# EAGLE design MergenElektronik_Developing-Board_ESP32 (EAGLE 9.6.2)

## Sheet 1 of 5
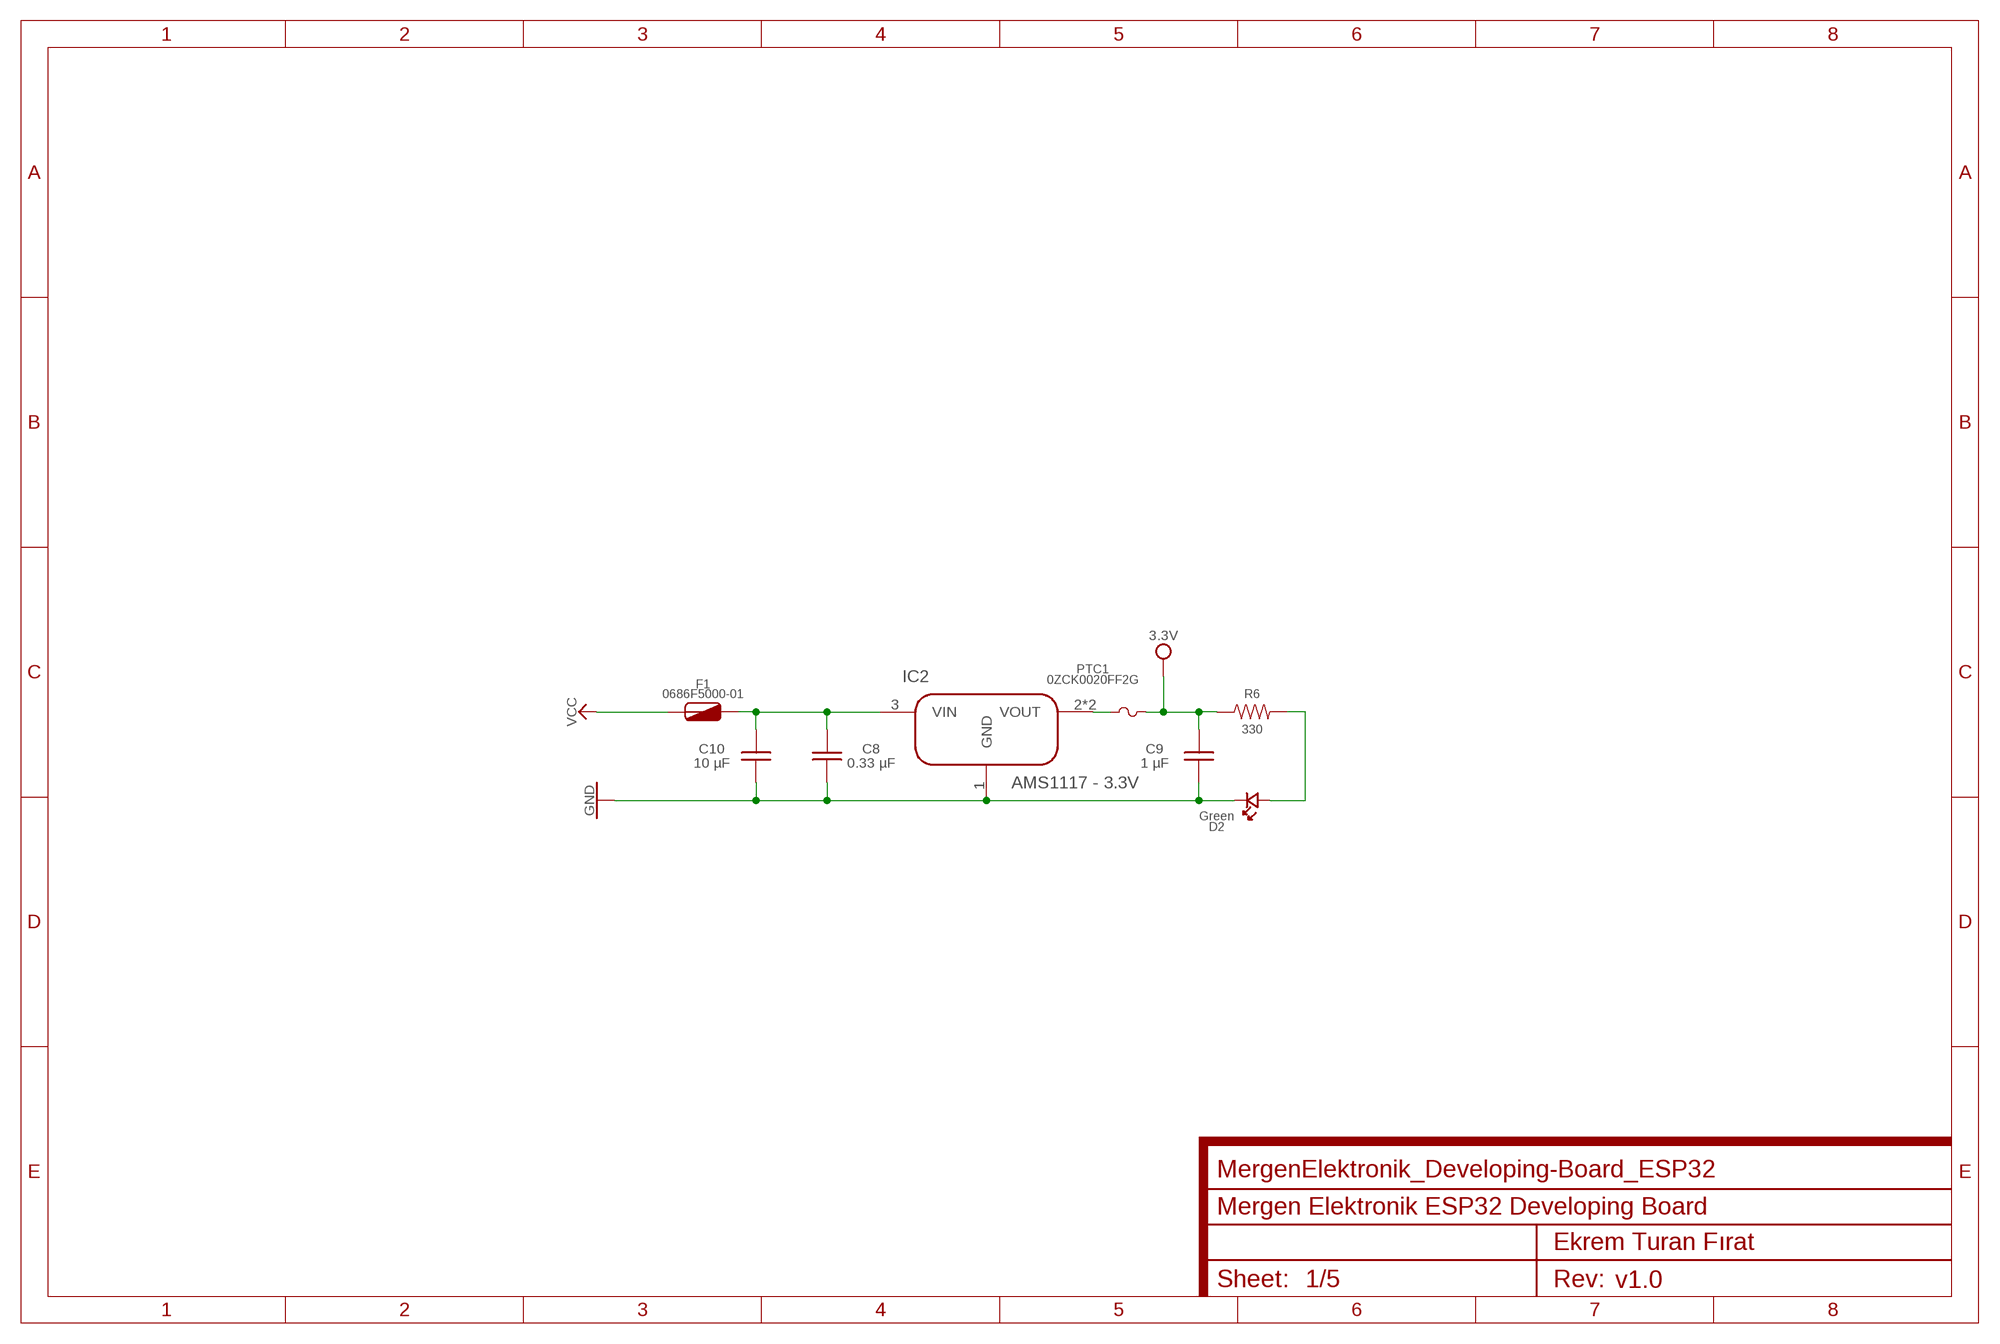
[diagram p0: schematic, sheet 1]
A4_PAGE1 (NACHTELK_AESTHETICS_A4): DRAWING_DESCRIPTION: Mergen Elektronik ESP32 Developing Board; DRAWING_DESIGNER: Ekrem Turan Fırat; DRAWING_REVISION: v1.0

### Parts
C8  0.33 µF  NACHTELK_CAP-NONPOLAR-SMD_0.33UF_0603  [0603]
C9  1 µF  NACHTELK_CAP-NONPOLAR-SMD_1UF_0603  [0603]
C10  10 µF  NACHTELK_CAP-NONPOLAR-SMD_10UF_0603  [0603]
D2  Green  NACHTELK_LED_SMD_0603_GREEN  [0603_GREEN]
F1  0686F5000-01  NACHTELK_FUSES_SMD_5A_0603  [0603]
IC2  AMS1117 - 3.3V  NACHTELK_LINEAR-REG_AMS1117_3.3V  [SOT-223]
PTC1  0ZCK0020FF2G  NACHHTELK_PTCS-SMD_0ZCK0020FF2G_0805  [0805]
R6  330  NACHTELK_RES-SMD_330R_0603  [0603]

### Nets
3V3: C9.1 PTC1.2 R6.1 ; supply symbol labelled 3.3V ; also sheet 2,4,5
GND: C8.2 C9.2 C10.2 D2.2(KATOT) IC2.1(GND) ; also sheet 2,3,4,5
N$1: D2.1(ANOT) R6.2
N$11: C8.1 C10.1 F1.2 IC2.3(VIN)
N$47: IC2.2(VOUT) IC2.4(VOUT) PTC1.1
VCC: F1.1 ; also sheet 2,5

## Sheet 2 of 5
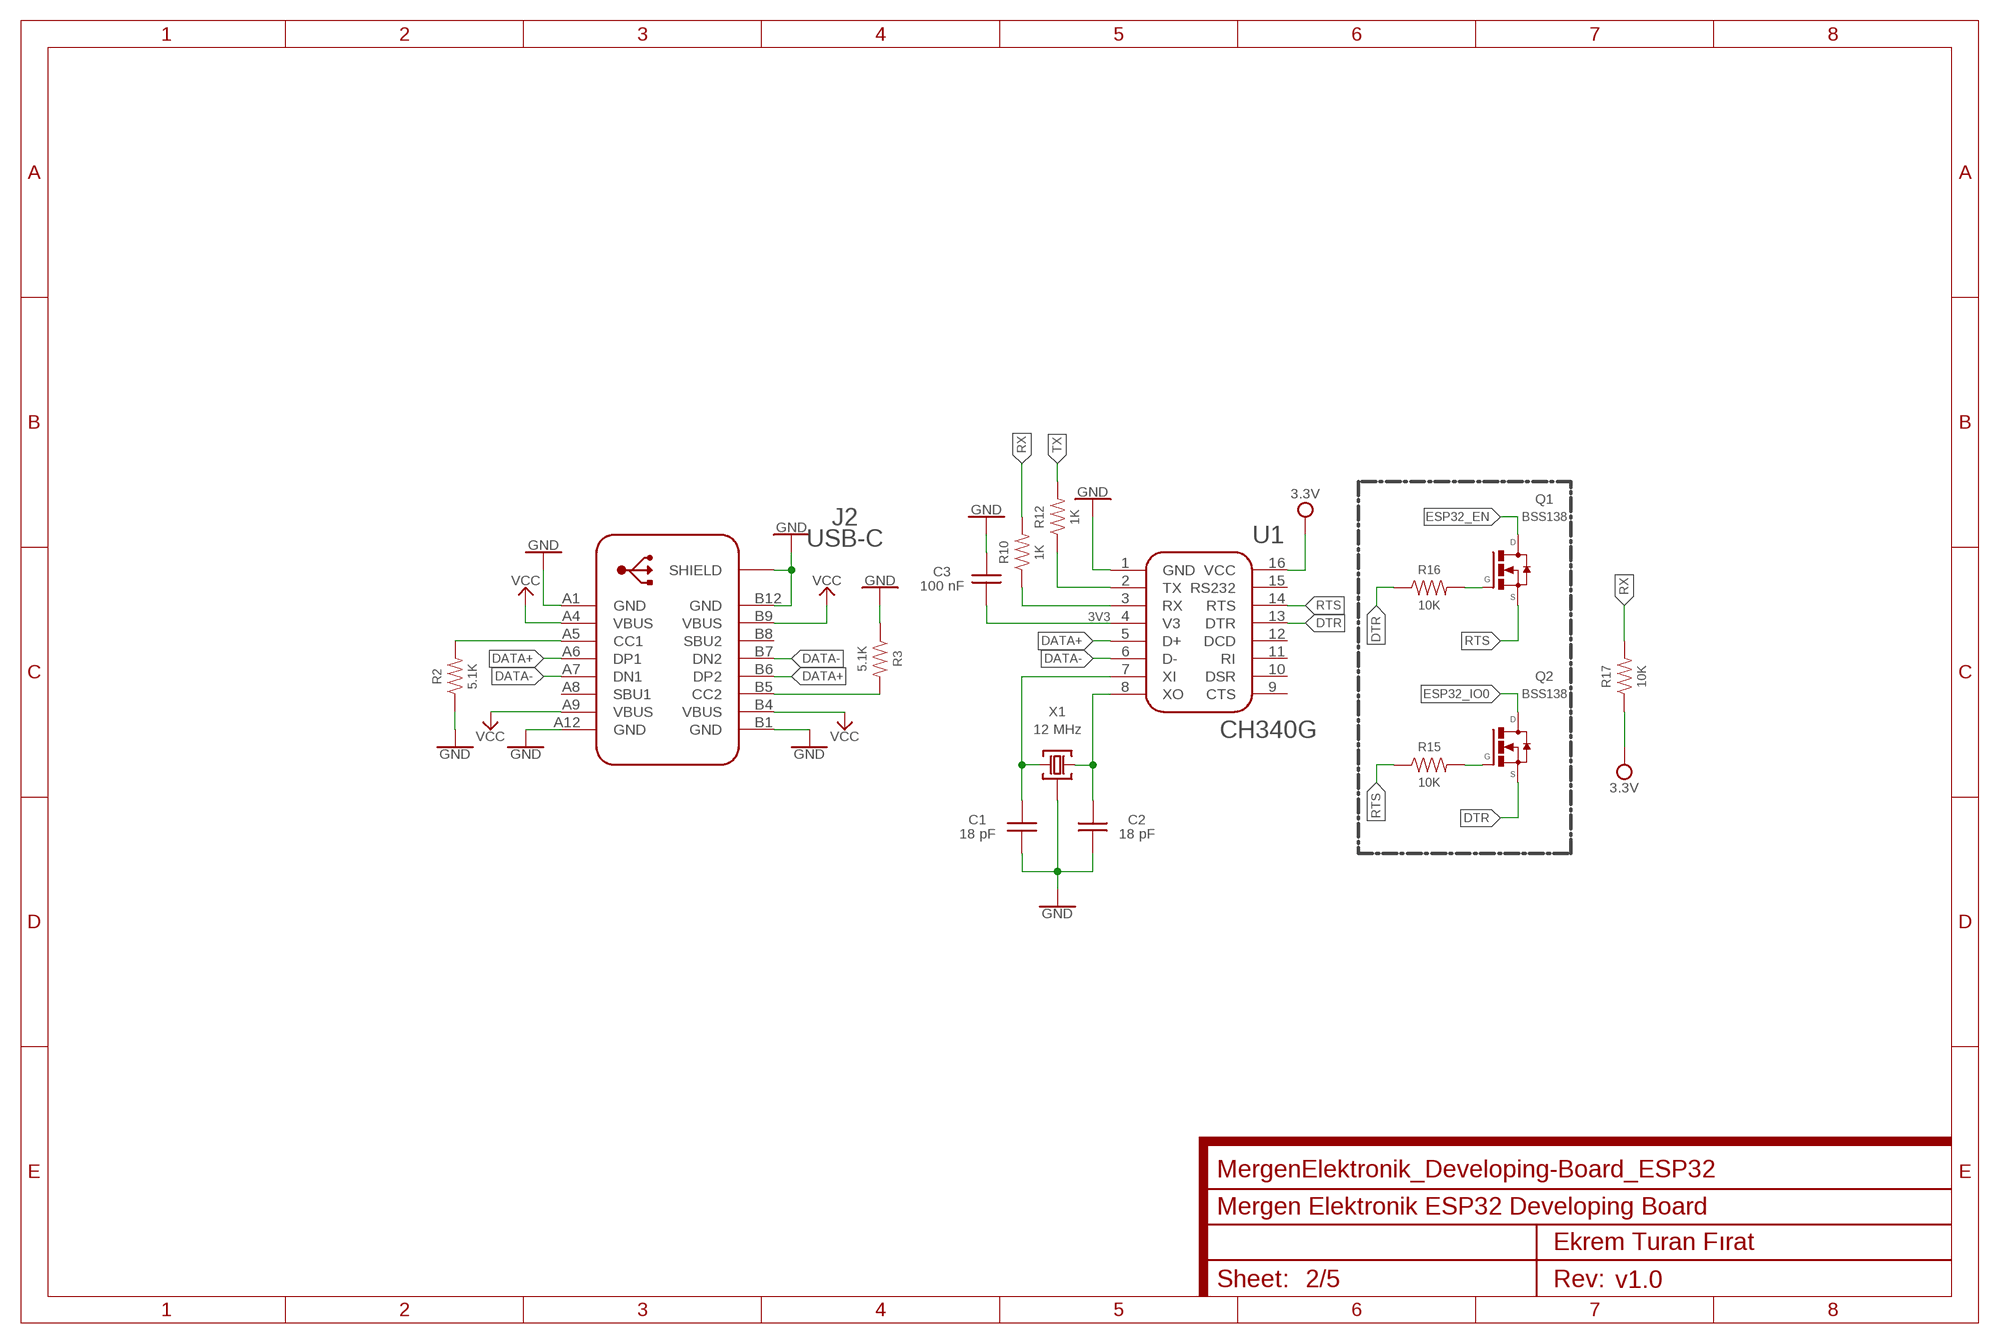
[diagram p1: schematic, sheet 2]
A4_PAGE3 (NACHTELK_AESTHETICS_A4): DRAWING_DESCRIPTION: Mergen Elektronik ESP32 Developing Board; DRAWING_DESIGNER: Ekrem Turan Fırat; DRAWING_REVISION: v1.0

### Parts
C1  18 pF  NACHTELK_CAP-NONPOLAR-SMD_18PF_0603  [0603]
C2  18 pF  NACHTELK_CAP-NONPOLAR-SMD_18PF_0603  [0603]
C3  100 nF  NACHTELK_CAP-NONPOLAR-SMD_100NF_0603  [0603]
J2  USB-C  NACHTELK_USBCONNECTORS_C-USB4105  [USB4105]
Q1  BSS138  NACHTELK_MOSFET_N-CH_BSS138_SOT-23_STYLE-21  [SOT-23]
Q2  BSS138  NACHTELK_MOSFET_N-CH_BSS138_SOT-23_STYLE-21  [SOT-23]
R2  5.1K  NACHTELK_RES-SMD_5.1K_0603  [0603]
R3  5.1K  NACHTELK_RES-SMD_5.1K_0603  [0603]
R10  1K  NACHTELK_RES-SMD_1K_0603  [0603]
R12  1K  NACHTELK_RES-SMD_1K_0603  [0603]
R15  10K  NACHTELK_RES-SMD_10K_0603  [0603]
R16  10K  NACHTELK_RES-SMD_10K_0603  [0603]
R17  10K  NACHTELK_RES-SMD_10K_0603  [0603]
U1  CH340G  NACHTELK_COMMUNICATION-UART_CH340  [SOIC-16]
X1  12 MHz  NACHTELK_CRYSTALS_EXTERNAL-G  [4-SMD]

### Nets
3V3: C3.2 R17.1 U1.4(V3) U1.16(VCC) ; supply symbol labelled 3.3V ; also sheet 1,4,5
DATA+: J2.A6(DP1) J2.B6(DP2) U1.5(D+)
DATA-: J2.A7(DN1) J2.B7(DN2) U1.6(D-)
DTR: Q2.2(S) R16.1 U1.13(DTR)
ESP32_EN: Q1.3(D) ; also sheet 4,5
ESP32_IO0: Q2.3(D) ; also sheet 4,5
GND: C1.2 C2.2 C3.1 J2.A1(GND) J2.A12(GND) J2.B1(GND) J2.B12(GND) J2.SH1(SHIELD) J2.SH2(SHIELD) J2.SH3(SHIELD) J2.SH4(SHIELD) R2.1 R3.1 U1.1(GND) X1.GND@1 X1.GND@2 ; also sheet 1,3,4,5
N$2: J2.A5(CC1) R2.2
N$3: J2.B5(CC2) R3.2
N$4: C1.1 U1.7(XI) X1.3
N$5: C2.1 U1.8(XO) X1.1
N$10: Q2.1(G) R15.2
N$13: R10.1 U1.3(RX)
N$14: R12.1 U1.2(TX)
N$16: Q1.1(G) R16.2
RTS: Q1.2(S) R15.1 U1.14(RTS)
RX: R10.2 R17.2 ; also sheet 5
TX: R12.2 ; also sheet 5
VCC: J2.A4(VBUS) J2.A9(VBUS) J2.B4(VBUS) J2.B9(VBUS) ; also sheet 1,5
Unconnected: J2.A8(SBU1) J2.B8(SBU2) U1.9(CTS) U1.10(DSR) U1.11(RI) U1.12(DCD) U1.15(RS232)

## Sheet 3 of 5
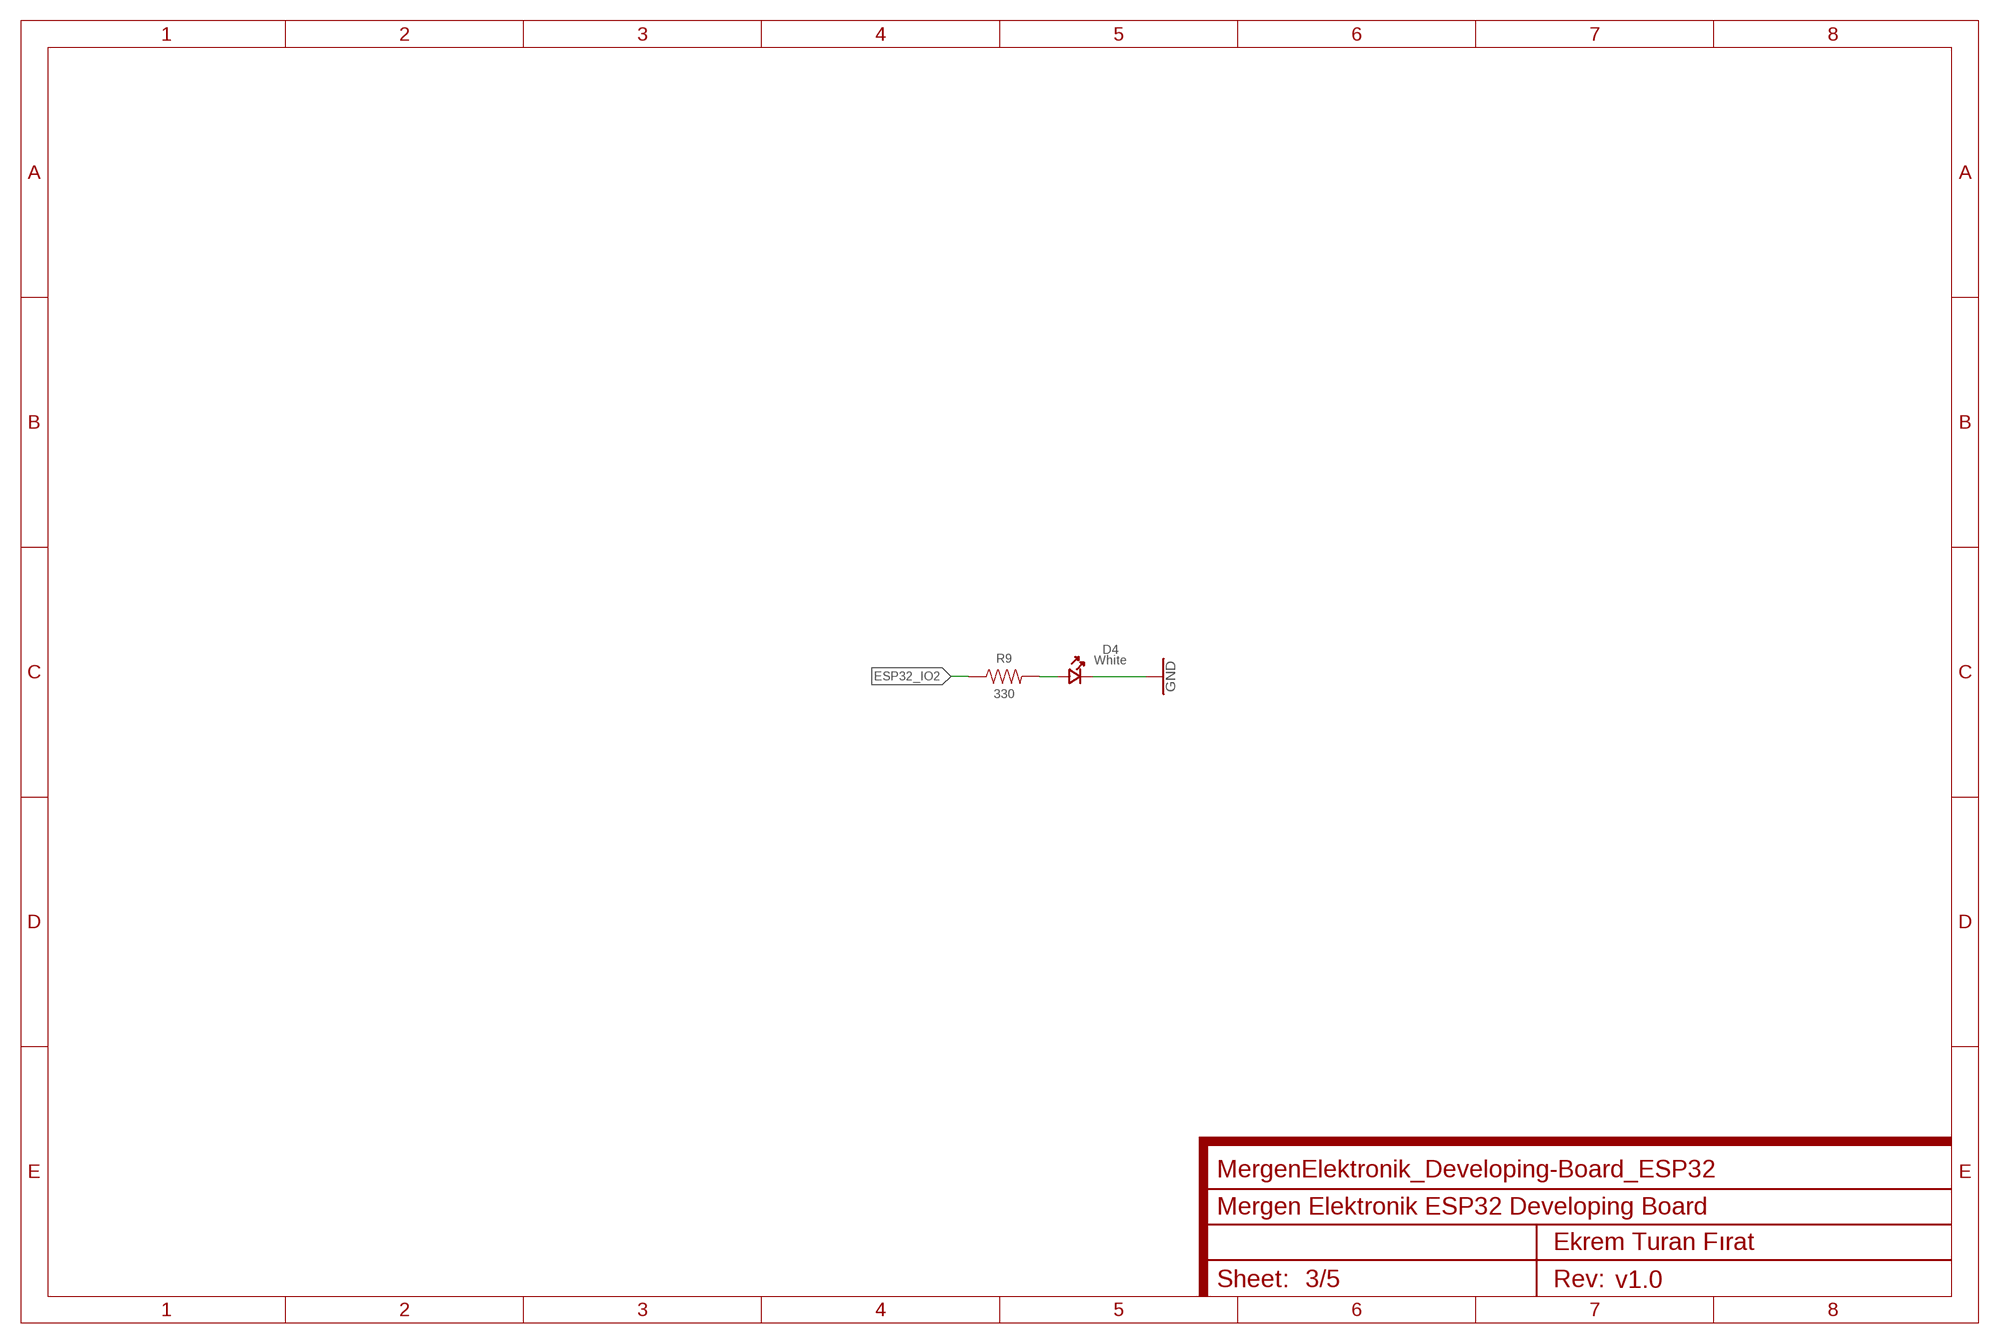
[diagram p2: schematic, sheet 3]
A4_PAGE6 (NACHTELK_AESTHETICS_A4): DRAWING_DESCRIPTION: Mergen Elektronik ESP32 Developing Board; DRAWING_DESIGNER: Ekrem Turan Fırat; DRAWING_REVISION: v1.0

### Parts
D4  White  NACHTELK_LED_SMD_0603_WHITE  [0603_WHİTE]
R9  330  NACHTELK_RES-SMD_330R_0603  [0603]

### Nets
ESP32_IO2: R9.1 ; also sheet 5
GND: D4.2(KATOT) ; also sheet 1,2,4,5
N$8: D4.1(ANOT) R9.2

## Sheet 4 of 5
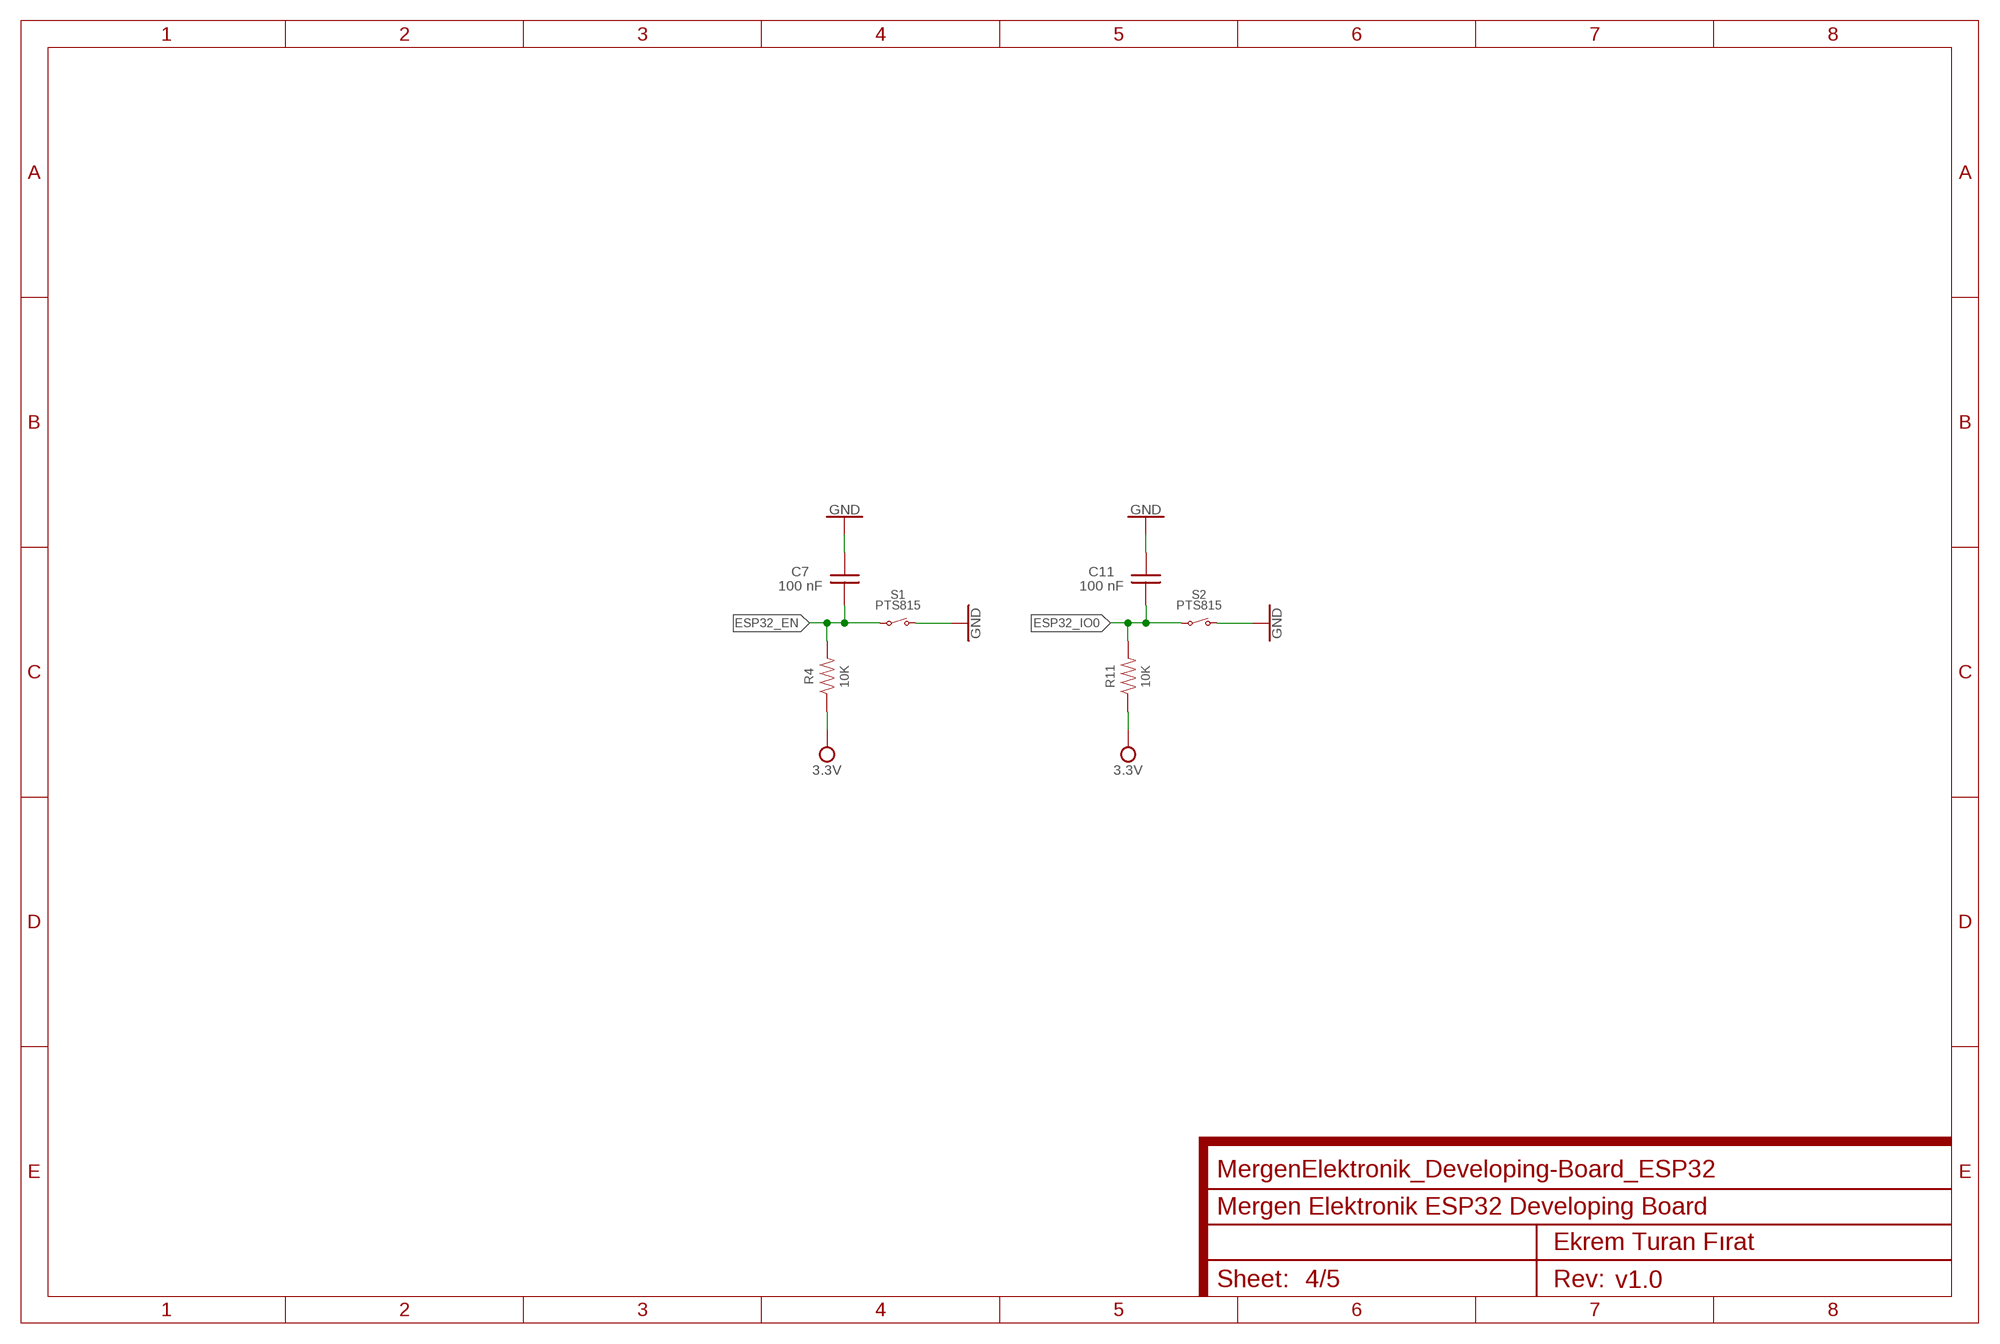
[diagram p3: schematic, sheet 4]
A4_PAGE5 (NACHTELK_AESTHETICS_A4): DRAWING_DESCRIPTION: Mergen Elektronik ESP32 Developing Board; DRAWING_DESIGNER: Ekrem Turan Fırat; DRAWING_REVISION: v1.0

### Parts
C7  100 nF  NACHTELK_CAP-NONPOLAR-SMD_100NF_0603  [0603]
C11  100 nF  NACHTELK_CAP-NONPOLAR-SMD_100NF_0603  [0603]
R4  10K  NACHTELK_RES-SMD_10K_0603  [0603]
R11  10K  NACHTELK_RES-SMD_10K_0603  [0603]
S1  PTS815  NACHTELK_BUTTONS_BUTTON_PTS815_PTS815  [PTS815]
S2  PTS815  NACHTELK_BUTTONS_BUTTON_PTS815_PTS815  [PTS815]

### Nets
3V3: R4.1 R11.1 ; supply symbol labelled 3.3V ; also sheet 1,2,5
ESP32_EN: C7.2 R4.2 S1.1(PASS1) S1.2(PASS1) ; also sheet 2,5
ESP32_IO0: C11.2 R11.2 S2.1(PASS1) S2.2(PASS1) ; also sheet 2,5
GND: C7.1 C11.1 S1.3(PASS2) S1.4(PASS2) S2.3(PASS2) S2.4(PASS2) ; also sheet 1,2,3,5

## Sheet 5 of 5
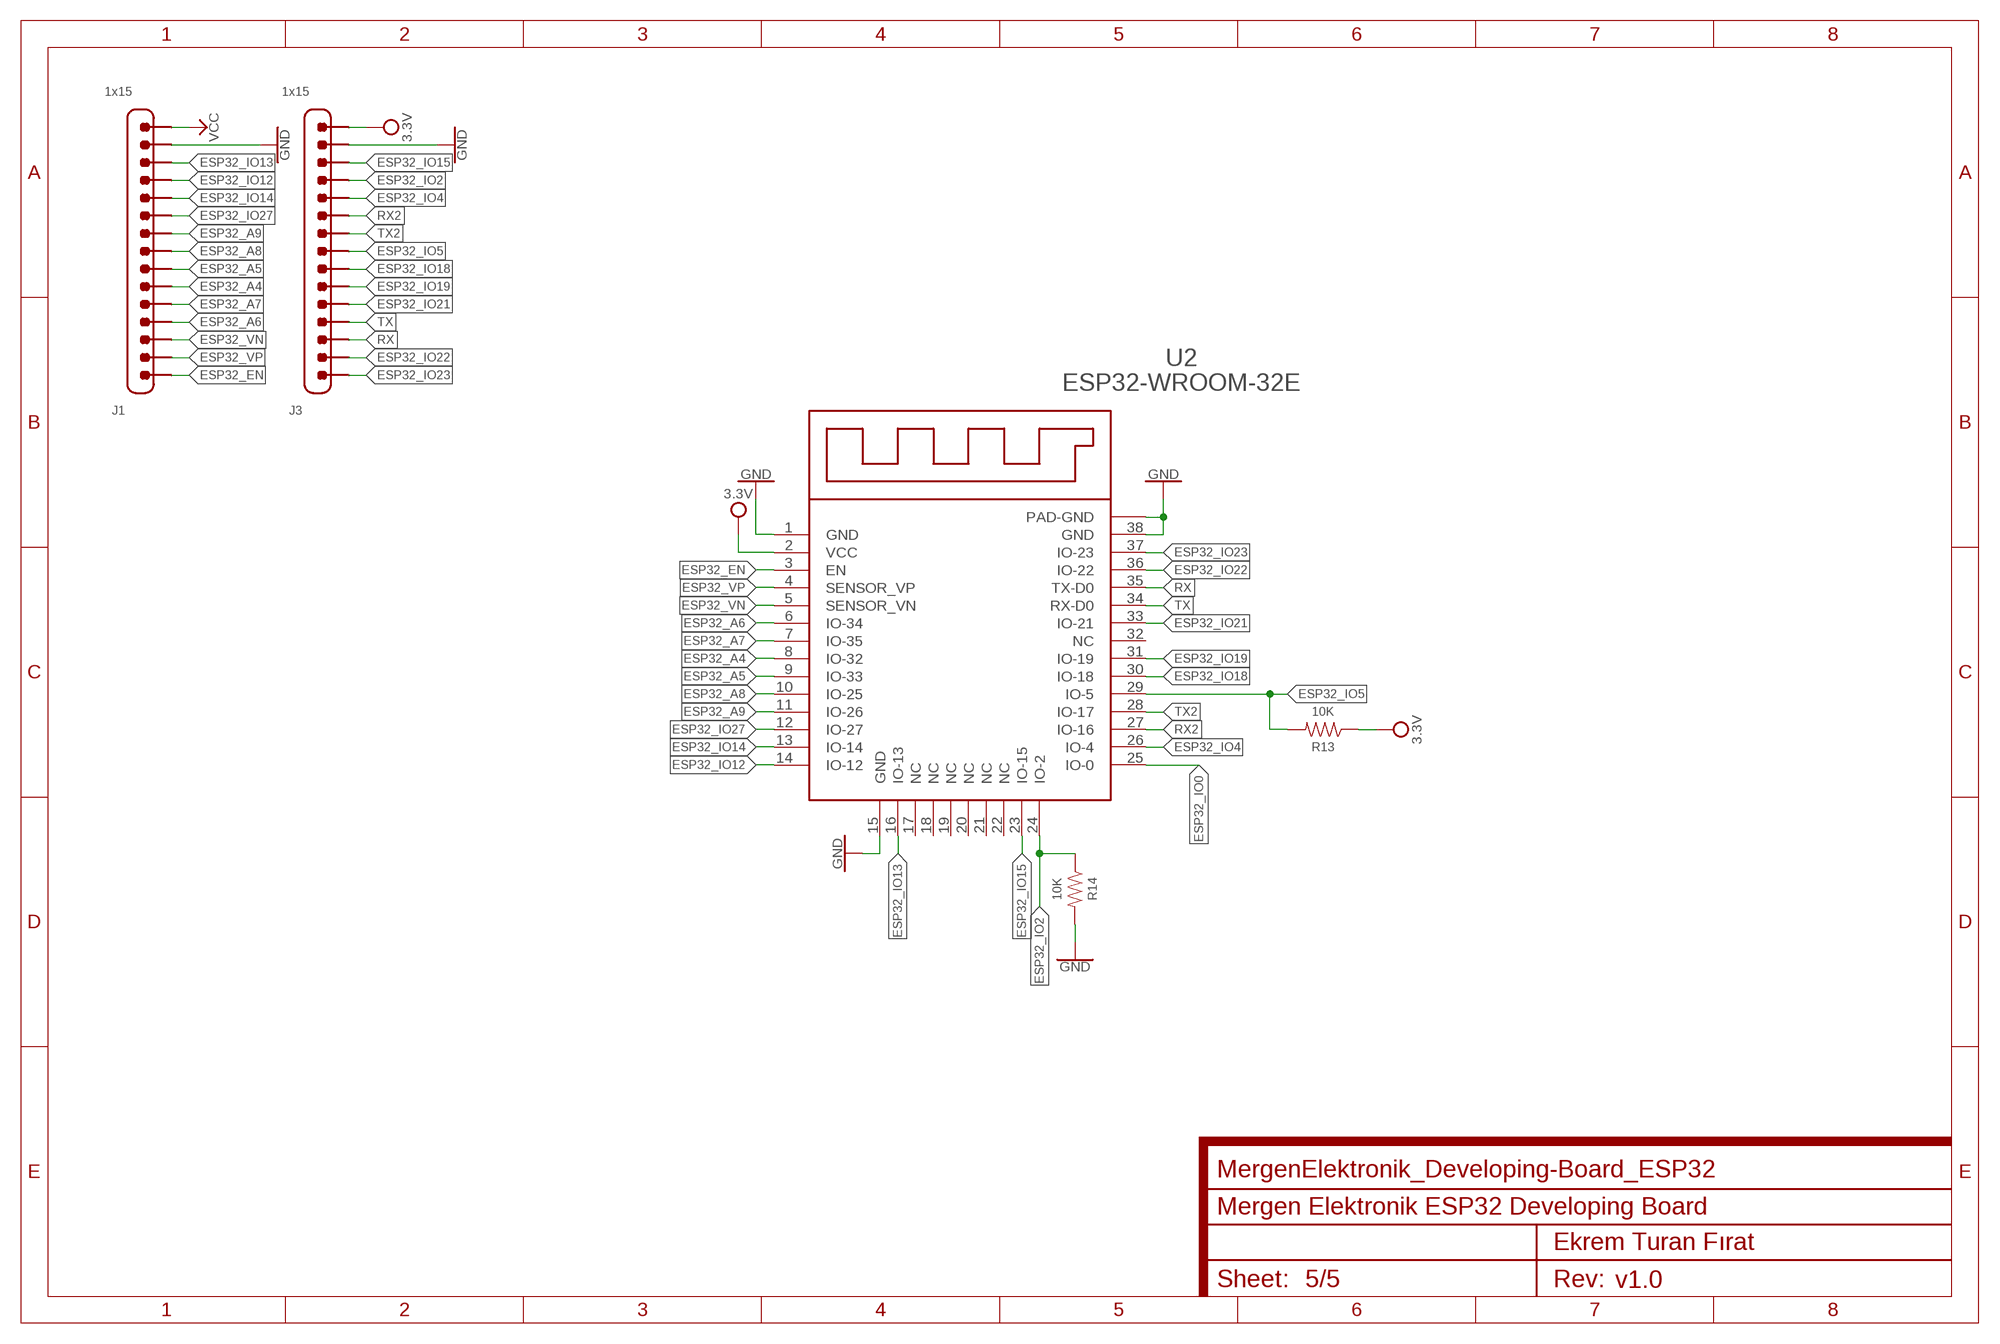
[diagram p4: schematic, sheet 5]
A4_PAGE4 (NACHTELK_AESTHETICS_A4): DRAWING_DESCRIPTION: Mergen Elektronik ESP32 Developing Board; DRAWING_DESIGNER: Ekrem Turan Fırat; DRAWING_REVISION: v1.0

### Parts
J1  1x15  NACHTELK_HEADERCONNECTORS_15_MALE  [HEADER_1X15]
J3  1x15  NACHTELK_HEADERCONNECTORS_15_MALE  [HEADER_1X15]
R13  10K  NACHTELK_RES-SMD_10K_0603  [0603]
R14  10K  NACHTELK_RES-SMD_10K_0603  [0603]
U2  ESP32-WROOM-32E  NACHTELK_MICROCONTROLLER_ESP_ESP32_WROOM_32E  [38-SMD_MODULE]

### Nets
3V3: J3.1 R13.1 U2.2(VCC) ; supply symbol labelled 3.3V ; also sheet 1,2,4
ESP32_A4: J1.10 U2.8(IO-32)
ESP32_A5: J1.9 U2.9(IO-33)
ESP32_A6: J1.12 U2.6(IO-34)
ESP32_A7: J1.11 U2.7(IO-35)
ESP32_A8: J1.8 U2.10(IO-25)
ESP32_A9: J1.7 U2.11(IO-26)
ESP32_EN: J1.15 U2.3(EN) ; also sheet 2,4
ESP32_IO0: U2.25(IO-0) ; also sheet 2,4
ESP32_IO2: J3.4 R14.1 U2.24(IO-2) ; also sheet 3
ESP32_IO4: J3.5 U2.26(IO-4)
ESP32_IO5: J3.8 R13.2 U2.29(IO-5)
ESP32_IO12: J1.4 U2.14(IO-12)
ESP32_IO13: J1.3 U2.16(IO-13)
ESP32_IO14: J1.5 U2.13(IO-14)
ESP32_IO15: J3.3 U2.23(IO-15)
ESP32_IO18: J3.9 U2.30(IO-18)
ESP32_IO19: J3.10 U2.31(IO-19)
ESP32_IO21: J3.11 U2.33(IO-21)
ESP32_IO22: J3.14 U2.36(IO-22)
ESP32_IO23: J3.15 U2.37(IO-23)
ESP32_IO27: J1.6 U2.12(IO-27)
ESP32_VN: J1.13 U2.5(SENSOR_VN)
ESP32_VP: J1.14 U2.4(SENSOR_VP)
GND: J1.2 J3.2 R14.2 U2.1(GND) U2.15(GND) U2.38(GND) U2.48(PAD-GND) U2.P$1(PAD-GND) ; also sheet 1,2,3,4
RX: J3.13 U2.35(TX-D0) ; also sheet 2
RX2: J3.6 U2.27(IO-16)
TX: J3.12 U2.34(RX-D0) ; also sheet 2
TX2: J3.7 U2.28(IO-17)
VCC: J1.1 ; also sheet 1,2
Unconnected: U2.17(NC) U2.18(NC) U2.19(NC) U2.20(NC) U2.21(NC) U2.22(NC) U2.32(NC)

## Library data of the parts
C1 C2 = NachtElk_CapacitorsCeramic_SMD:NACHTELK_CAP-NONPOLAR-SMD: Nacht Elk. - Ceramic Capacitors Ekrem Turan Fırat Nacht Elk. - Ceramic Capacitors Value: 1pF - 100 µF Maximum operating voltage: 6.3V - 10V - 16V - 25V - 50V Tolerance: 10% -20% Operating temperature: -55 °C up to +125°C Mount Type: SMD Package: 0402 - 0603(1608) - 0805(2012) - 1210 01.02.2022; DIGI-KEY_NUMBER: 311-1061-1-ND; MOUNT-TYPE: SMD; PACKAGE: 0603(1806); PART-NUMBER: CC0603JRNPO9BN180; TEMPERATURE: -55 °C up to +125°C; TOLERANCE: 5%; VOLTAGE: 50V
C3 C7 C11 = NachtElk_CapacitorsCeramic_SMD:NACHTELK_CAP-NONPOLAR-SMD: Nacht Elk. - Ceramic Capacitors Ekrem Turan Fırat Nacht Elk. - Ceramic Capacitors Value: 1pF - 100 µF Maximum operating voltage: 6.3V - 10V - 16V - 25V - 50V Tolerance: 10% -20% Operating temperature: -55 °C up to +125°C Mount Type: SMD Package: 0402 - 0603(1608) - 0805(2012) - 1210 01.02.2022; DIGI-KEY_NUMBER: 1276-CL10B104KB8NNNLCT-ND; MOUNT-TYPE: SMD; PACKAGE: 0603(1806); PART-NUMBER: CL10B104KB8NNNL; TEMPERATURE: -55 °C up to +125°C; TOLERANCE: 10%; VOLTAGE: 50V
C8 = NachtElk_CapacitorsCeramic_SMD:NACHTELK_CAP-NONPOLAR-SMD: Nacht Elk. - Ceramic Capacitors Ekrem Turan Fırat Nacht Elk. - Ceramic Capacitors Value: 1pF - 100 µF Maximum operating voltage: 6.3V - 10V - 16V - 25V - 50V Tolerance: 10% -20% Operating temperature: -55 °C up to +125°C Mount Type: SMD Package: 0402 - 0603(1608) - 0805(2012) - 1210 01.02.2022; DIGI-KEY_NUMBER: 445-5950-1-ND; MOUNT-TYPE: SMD; PACKAGE: 0603(1806); PART-NUMBER: C1608X7R1H334K080AC; TEMPERATURE: -55 °C up to +125°C; TOLERANCE: 10%; VOLTAGE: 50V
C9 = NachtElk_CapacitorsCeramic_SMD:NACHTELK_CAP-NONPOLAR-SMD: Nacht Elk. - Ceramic Capacitors Ekrem Turan Fırat Nacht Elk. - Ceramic Capacitors Value: 1pF - 100 µF Maximum operating voltage: 6.3V - 10V - 16V - 25V - 50V Tolerance: 10% -20% Operating temperature: -55 °C up to +125°C Mount Type: SMD Package: 0402 - 0603(1608) - 0805(2012) - 1210 01.02.2022; DIGI-KEY_NUMBER: 1276-1860-1-ND; MOUNT-TYPE: SMD; PACKAGE: 0603(1806); PART-NUMBER: CL10A105KB8NNNC; TEMPERATURE: -55 °C up to +85°C; TOLERANCE: 10%; VOLTAGE: 50V
C10 = NachtElk_CapacitorsCeramic_SMD:NACHTELK_CAP-NONPOLAR-SMD: Nacht Elk. - Ceramic Capacitors Ekrem Turan Fırat Nacht Elk. - Ceramic Capacitors Value: 1pF - 100 µF Maximum operating voltage: 6.3V - 10V - 16V - 25V - 50V Tolerance: 10% -20% Operating temperature: -55 °C up to +125°C Mount Type: SMD Package: 0402 - 0603(1608) - 0805(2012) - 1210 01.02.2022; DIGI-KEY_NUMBER: 490-12323-1-ND; MOUNT-TYPE: SMD; PACKAGE: 0603(1806); PART-NUMBER: GRT188R61E106ME13D; TEMPERATURE: -55 °C up to +185°C; TOLERANCE: 10%; VOLTAGE: 25V
D2 = NachtElk_Leds_SMD:NACHTELK_LED_SMD: Nacht Elk. - LEDs SMD Ekrem Turan Fırat Nacht Elk. - LEDs SMD Color: White - Blue - Green - Red Operating temperature: -40 °C up to +85°C Package: 0402 - 0603(1608) - 0805 - 1206 - 2810 - 2835 - 3020 - 3528 - 5630 - 5050 08.04.2022; COLOR: GREEN; DIGI-KEY_NUMBER: 732-4971-1-ND; MOUNT-TYPE: SMD; PACKAGE: 0603(1608); PART-NUMBER: 150060GS75000; TEMPERATURE: -40 °C up to +85°C; VOLTAGE: 3.2V
D4 = NachtElk_Leds_SMD:NACHTELK_LED_SMD: Nacht Elk. - LEDs SMD Ekrem Turan Fırat Nacht Elk. - LEDs SMD Color: White - Blue - Green - Red Operating temperature: -40 °C up to +85°C Package: 0402 - 0603(1608) - 0805 - 1206 - 2810 - 2835 - 3020 - 3528 - 5630 - 5050 08.04.2022; COLOR: WHITE; DIGI-KEY_NUMBER: 3147-B1931TW--20P000314U1930CT-ND; MOUNT-TYPE: SMD; PACKAGE: 0603(1608); PART-NUMBER: B1931TW--20P000314U1930; TEMPERATURE: -40 °C up to +85°C; VOLTAGE: 3.2V
F1 = NachtElk_Fuses:NACHTELK_FUSES_SMD: Nacht Elk. - Fuses Ekrem Turan Frat Nacht Elk. - Fuses SMD Breaking Capacity: 5A DC Voltage Rating: 63V AC Voltage Rating: 32V Temprature: -55°C up to +125°C Package: 0603(1608) 11.08.2022; AC-VOLTAGE: 32V; AMP: 5A; DC-VOLTAGE: 63V; DIGI-KEY_NUMBER: 507-2155-1-ND; MOUNT-TYPE: SMD; PACKAGE: 0603(1608); PART-NUMBER: 0686F5000-01; TEMPERATURE: -55°C up to +125°C
IC2 = NachtElk_LinearRegs:NACHTELK_LINEAR-REG_AMS1117: Nacht Elk. - Linear Voltage Regulators Ekrem Turan Fırat Nacht Elk. - AMS1117 Output Voltage Range: 1.2V - 5V - ADJ Max Output Current: 1A Max. Input Voltage: 18V Operating temperature: -20 °C up to +125°C Package: SOT-223 Mount Type: SMD Datasheet <https://cdn.ozdisan.com/ETicaret_Dosya/348307_6210366.pdf> 04.02.2022; AMP: 1A; DIGI-KEY_NUMBER: NCP1117ST33T3GOSCT-ND; INPUT: >4.9V; MOUNT-TYPE: SMD; OUTPUT: 3.3V; PACKAGE: SOT-223; PART-NUMBER: NCP1117ST33T3G; TEMPERATURE: 0 °C up to +125°C
J1 J3 = NachtElk_HeaderConnectors:NACHTELK_HEADERCONNECTORS_15: Nacht Elk. - Header Connectors Ekrem Turan Fırat Nacht Elk. - Header Connectors 1x15 Female or Male Pin Spacing: 2.54mm Mount Type: DIP Operating Temperature: -40°C up to 105°C 17.02.2022; MOUNT-TYPE: DIP; TEMPERATURE: -40°C up to 105°C; TYPE: Male
J2 = NachtElk_USBConnectors:NACHTELK_USBCONNECTORS_C-USB4105: Nacht Elk. - USB Connectors Ekrem Turan Fırat Nacht Elk. - USB Connectors USB(2.0): Type-C Connector Model: USB4105 Current Rating: 5A Operating Temperature: -40°C up to 85°C Package: USB4105 Mount Type: SMD THT R/A Datasheet <https://gct.co/files/drawings/usb4105.pdf> 12.07.2022; AMP: 5A; DIGI-KEY_NUMBER: 2073-USB4105-GF-ACT-ND; MODEL: USB4105; MOUNT-TYPE: SMD-THT R/A; PACKAGE: USB4105; PART-NUMBER: USB4105-GF-A; TEMPERATURE: -40°C up to 85°C; USB_TYPE: USB-C
PTC1 = NachtElk_PTCs:NACHHTELK_PTCS-SMD: Nacht Elk. - PTC SMD Ekrem Turan Fırat Nacht Elk. - Resistor SMD Voltage: 9V Trip Currents: 500 mA Hold Currents: < strong> 200 mA MAX Currents: < strong> 100A Operating temperature: -45 °C up to 85°C Package: 0402 - 0603(1608) - 0805 - 1206 - 1210 - 2010 - 2512 22.08.2021; DIGI-KEY_NUMBER: 507-1811-1-ND; HOLD: 200 mA; MAX: 100 A; MOUNT-TYPE: SMD; PACKAGE: 0805(2012); PART-NUMBER: 0ZCK0020FF2G; TEMPERATURE: -40°C up to +85°C; TRIP: 500 mA; VOLTAGE: 9V
Q1 Q2 = NachtElk_Mosfets:NACHTELK_MOSFET_N-CH: Nacht Elk. - Mosfets Ekrem Turan Fırat Nacht Elk. - Mosfets N-CH Company: onsemi Model: BSS138 Channel Type: N - Channel Drain to Source Voltage (Vdss): 50V Current - Continuous Drain: 200 mA Operating temperature: -55 °C up to +150°C Package: SOT-23 04.08.2022; AMP: 200 Ma; COMPANY: onsemi; DIGI-KEY_NUMBER: BSS138LT1GOSCT-ND; MODEL: BSS138; MOUNT-TYPE: SMD; PACKAGE: SOT-23; PART-NUMBER: BSS138LT1G; TEMPERATURE: -55 °C up to +150°C; TYPE: N - Channel; VDSS: 50V
R2 R3 = NachtElk_Resistors_SMD:NACHTELK_RES-SMD: Nacht Elk. - Resistor SMD Ekrem Turan Fırat Nacht Elk. - Resistor SMD Value: 1/8W - 1/10W 0R - 2.2MR Tolerance: %1 - %5 Operating temperature: -55 °C up to +155°C Package: 0402 - 0603(1608) - 0805 - 1206 - 1210 - 2010 - 2512 25.12.2021; DIGI-KEY_NUMBER: RMCF0603FT5K10CT-ND; MOUNT-TYPE: SMD; PACKAGE: 0603(1608); PART-NUMBER: RMCF0603FT5K10; POWER: 1/10W; TEMPERATURE: -55 °C up to +155°C; TOLERANCE: %1
R4 R11 R13-R17 = NachtElk_Resistors_SMD:NACHTELK_RES-SMD: Nacht Elk. - Resistor SMD Ekrem Turan Fırat Nacht Elk. - Resistor SMD Value: 1/8W - 1/10W 0R - 2.2MR Tolerance: %1 - %5 Operating temperature: -55 °C up to +155°C Package: 0402 - 0603(1608) - 0805 - 1206 - 1210 - 2010 - 2512 25.12.2021; DIGI-KEY_NUMBER: RMCF0603JT10K0CT-ND; MOUNT-TYPE: SMD; PACKAGE: 0603(1608); PART-NUMBER: RMCF0603JT10K0; POWER: 1/10W; TEMPERATURE: -55 °C up to +155°C; TOLERANCE: %5
R6 R9 = NachtElk_Resistors_SMD:NACHTELK_RES-SMD: Nacht Elk. - Resistor SMD Ekrem Turan Fırat Nacht Elk. - Resistor SMD Value: 1/8W - 1/10W 0R - 2.2MR Tolerance: %1 - %5 Operating temperature: -55 °C up to +155°C Package: 0402 - 0603(1608) - 0805 - 1206 - 1210 - 2010 - 2512 25.12.2021; DIGI-KEY_NUMBER: RMCF0603JT330RCT-ND; MOUNT-TYPE: SMD; PACKAGE: 0603(1608); PART-NUMBER: RMCF0603JT330R; POWER: 1/10W; TEMPERATURE: -55 °C up to +155°C; TOLERANCE: %5
R10 R12 = NachtElk_Resistors_SMD:NACHTELK_RES-SMD: Nacht Elk. - Resistor SMD Ekrem Turan Fırat Nacht Elk. - Resistor SMD Value: 1/8W - 1/10W 0R - 2.2MR Tolerance: %1 - %5 Operating temperature: -55 °C up to +155°C Package: 0402 - 0603(1608) - 0805 - 1206 - 1210 - 2010 - 2512 25.12.2021; DIGI-KEY_NUMBER: RMCF0603JT1K00CT-ND; MOUNT-TYPE: SMD; PACKAGE: 0603(1608); PART-NUMBER: RMCF0603JT1K00; POWER: 1/10W; TEMPERATURE: -55 °C up to +155°C; TOLERANCE: %5
S1 S2 = NachtElk_Buttons:NACHTELK_BUTTONS_BUTTON: Nacht Elk. - Buttons Ekrem Turan Fırat Nacht Elk. - Buttons Push Model: KPT-1187B - PTS815 Max Voltage: 12V Company: SparkFun Amp: 50 mA Mount Type: SMD Package: KPT-1187B - PTS815 08.08.2022; AMP: 50 mA; COMPANY: C&K; DIGI-KEY_NUMBER: CKN12215-1-ND; MODEL: PTS815; MOUNT-TYPE: SMD; PACKAGE: PTS815; PART-NUMBER: PTS815 SJM 250 SMTR LFS; VOLTAGE: 12V
U1 = NachtElk_Communication_Uart:NACHTELK_COMMUNICATION-UART_CH340: Nacht Elk. - Communication UART Technology Ekrem Turan Fırat Nacht Elk. - UART CH340G Company: WCH Operating Voltage: 3.3V and 5V Operating Speed: 12MHz Baud rate: 50bps up to 2Mbps Operating temperature: -40 °C up to +85°C Package: SOIC-16 Datasheet <https://www.robolinkmarket.com/Data/EditorFiles/PDF/ch340g-ic-datasheet.pdf> 20.01.2022; BAUD-RATE: 50bps up to 2Mbps; PACKAGE: SOIC-16; SPEED: 12MHz; TEMPERATURE: -40 °C up to +85°C; VOLTAGE: 3.3V and 5V
U2 = NachtElk_MicroController_Espressif-Systems_ESPs:NACHTELK_MICROCONTROLLER_ESP_ESP32_WROOM_32E: Nacht Elk. - Espressif Systems ESP Modules Ekrem Turan Fırat Nacht Elk. - Espressif Systems ESP32-WROOM-32E Company: Espressif Systems Model: ESP32-WROOM-32E Microcontroller Type: Xtensa Operating Voltage: 3V up to 3,6V Operating Speed: 80Mhz UP TO 240MHz Memory: 4MB Number of I/O pins: 26 Operating temperature: -40 °C up to +85°C Package: 38-SMD Module Datasheet <https://www.espressif.com/sites/default/files/documentation/esp32-wroom-32e_esp32-wroom-32ue_datasheet_en.pdf> 05.07.2022; COMPANY: Espressif Systems; DIGI-KEY_NUMBER: 1965-ESP32-WROOM-32E-N4CT-ND; MCROCONTROLLER-TYPE: Xtensa; MEMORY: 4MB; MODEL: ESP32-WROOM-32E; MOUNT-TYPE: SMD; PACKAGE: 38-SMD Module; PART-NUMBER: ESP32-WROOM-32E-N4; SPEED: 80MHz up to 240 MHz; TEMPERATURE: -40°C up to 85°C; VOLTAGE: 3V up to 3,6
X1 = NachtElk_Crystals:NACHTELK_CRYSTALS_EXTERNAL-G: Nacht Elk. - Crystals Ekrem Turan Fırat Nacht Elk. - Crystals Value:12 MHz Load Capacitance: 18 pF Frequency Tolerance: ±20ppm Operating temperature: -20 °C up to +70°C Package: 4-SMD 01.08.2022; DIGI-KEY_NUMBER: 2151-RH100-12.000-18-2030-TRCT-ND; LOAD-CAPACITANCE: 18 pF; MOUNT-TYPE: SMD; PACKAGE: 4-SMD; PART-NUMBER: RH100-12.000-18-2030-TR; TEMPERATURE: -20°C up to +70°C; TOLERANCE: ±20ppm

## Board
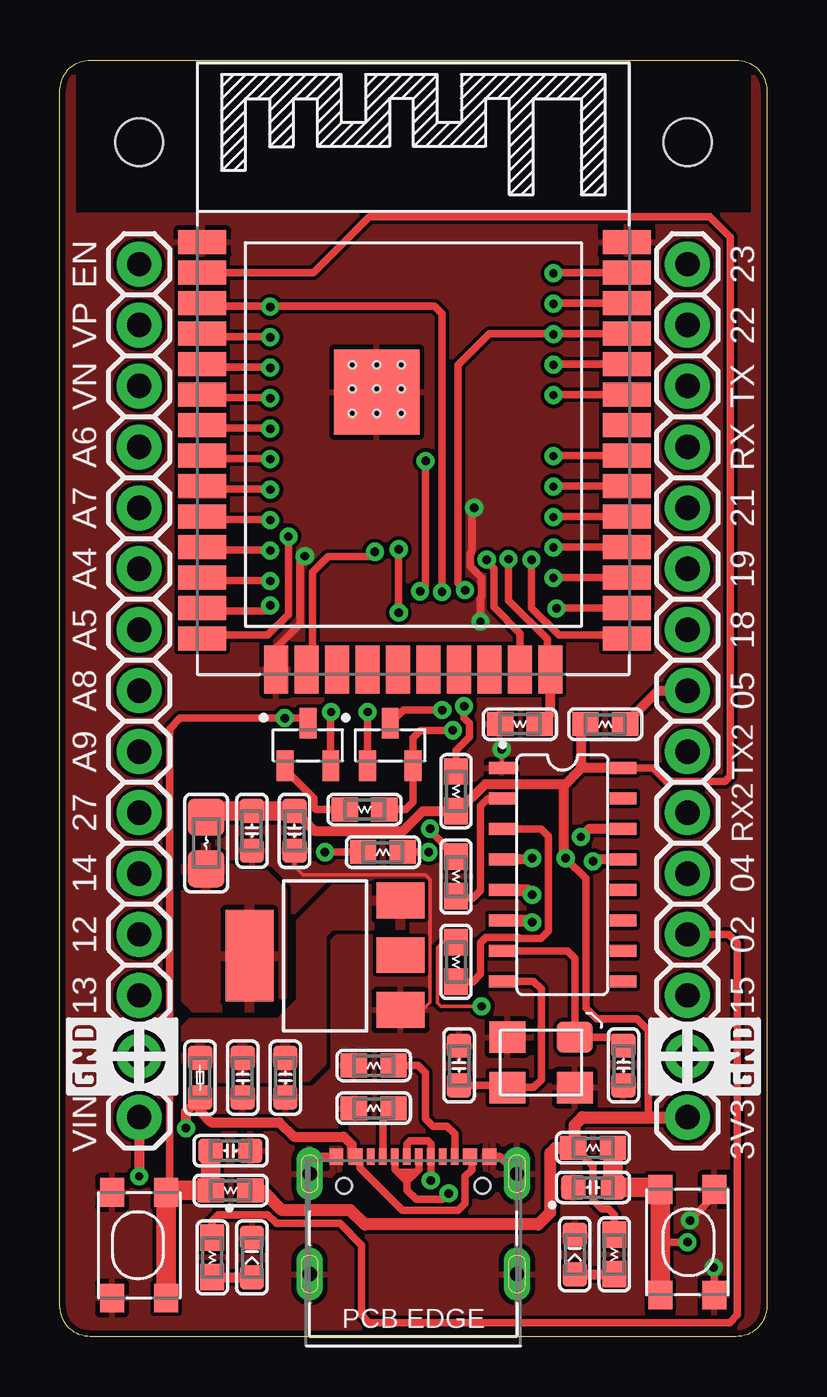
[diagram p5: board, top side]
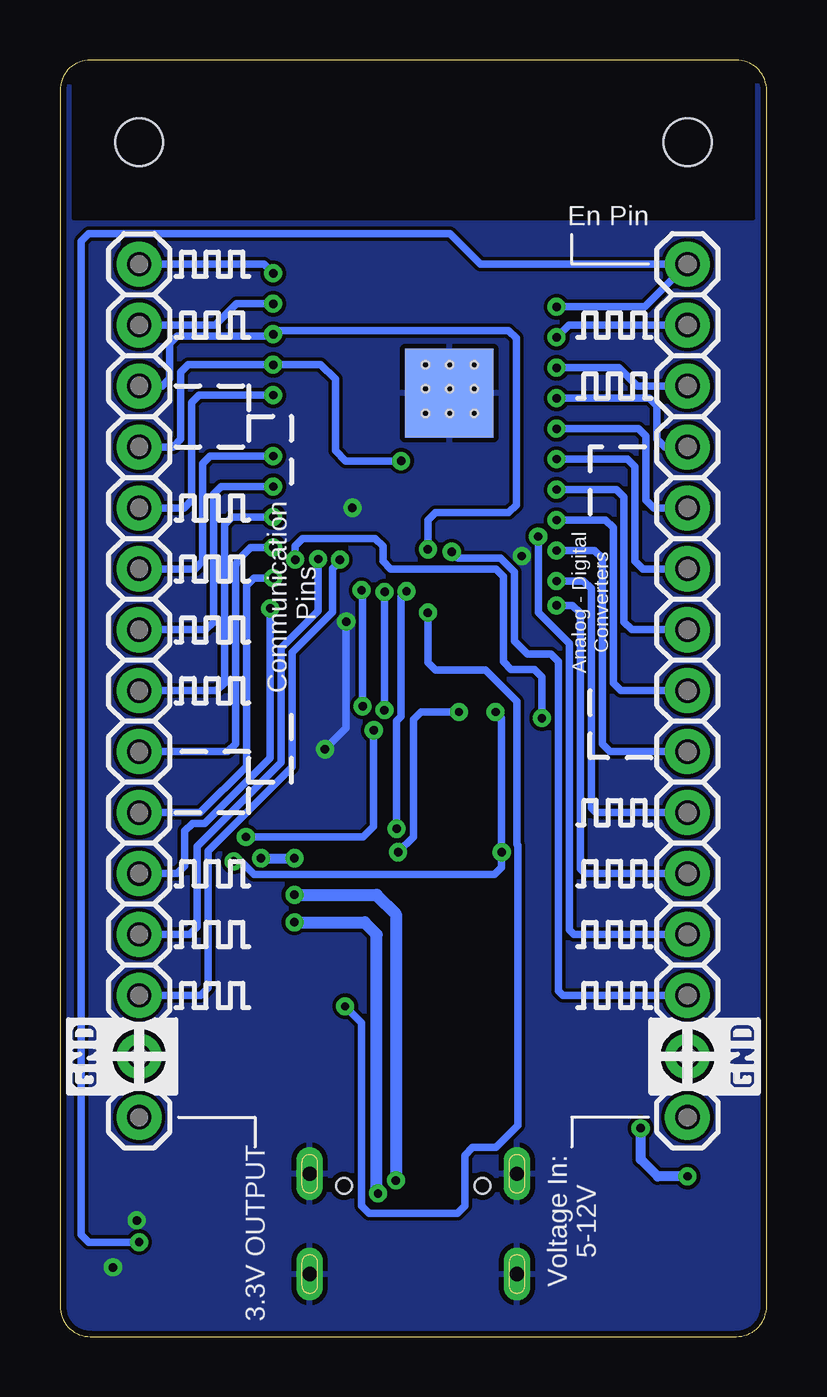
[diagram p6: board, bottom side, seen from below]

Size 29.46 x 53.21 mm. Coordinates in mm from the lower left corner, seen from the top.
Outline: 0,1.27 0,51.94 arc-90 1.27,53.21 28.19,53.21 arc-90 29.46,51.94 29.46,1.27 arc-90 28.19,0 1.27,0 arc-90 0,1.27
Copper layers (1*16): Top 0.035mm / dielectric 1.5mm / Bottom 0.035mm
Design rules "NachtElk_DRU": minimum track width 6mil, minimum drill 0.35mm, track to track 6mil, track to pad 6mil, pad to pad 6mil, via to via 6mil, smd to smd 6mil, copper to edge 10mil, drill to drill 6mil, minimum pad ring 10mil, minimum via ring 8mil, stop-mask expansion 4mil, vias tented up to drill 25mil, thermal gap 8mil
Holes 2 mm at 3.3,49.78 26.16,49.78
tRestrict: area 0.8,47.2 to 5.8,52.3

### Footprints (pad centres in the part's own frame; a part is rotated, then mirrored left to right if it is on the bottom)
0603 = smd 1.016 x 1.016: 1 -0.826,0; 2 0.826,0
0603_GREEN = smd 1.016 x 1.016: 1 -0.826,0; 2 0.826,0
0603_WHİTE = smd 1.016 x 1.016: 1 -0.826,0; 2 0.826,0
SOT-223 = smd 1.499 x 2.007: 1 -2.261,-3.15; 2 0.025,-3.15; 3 2.311,-3.15 | smd 3.81 x 2.007: 4 0,3.15
HEADER_1X15 = drill 1.016 pad 1.88: 1 0,0; 2 2.54,0; 3 5.08,0; 4 7.62,0; 5 10.16,0; 6 12.7,0; 7 15.24,0; 8 17.78,0; 9 20.32,0; 10 22.86,0; 11 25.4,0; 12 27.94,0; 13 30.48,0; 14 33.02,0; 15 35.56,0
USB4105 = smd 0.3 x 0.7: A1 -3.35,3.825; A4 -2.55,3.825; A5 -1.27,3.825; A6 -0.27,3.825; A7 0.23,3.825; A8 1.23,3.825; A9 2.51,3.825; A12 3.31,3.825; B1 3.03,3.825; B4 2.23,3.825; B5 1.73,3.825; B6 0.73,3.825; B7 -0.77,3.825; B8 -1.77,3.825; B9 -2.27,3.825; B12 -3.07,3.825 | drill 0.6 pad 1 long: SH1 -4.32,-1.075; SH2 -4.32,3.105; SH3 4.32,3.105; SH4 4.32,-1.075 | hole 0.65: -2.89,2.605; 2.89,2.605
0805 = smd 1.524 x 1.524: 1 -1.079,0; 2 1.079,0
SOT-23 = smd 0.7 x 1.27: 1 0.5,-0.206; 2 2.4,-0.206; 3 1.45,1.559
0603' = smd 1.1 x 1: 1 -0.826,0; 2 0.826,0
PTS815 = smd 1.2 x 1: 1 -2.2,1.125; 2 2.2,1.125; 3 2.2,-1.125; 4 -2.2,-1.125
SOIC-16 = smd 1.1 x 0.5: 1 -2.527,4.521; 2 -2.527,3.251; 3 -2.527,1.981; 4 -2.527,0.711; 5 -2.527,-0.559; 6 -2.527,-1.829; 7 -2.527,-3.099; 8 -2.527,-4.369; 9 2.518,-4.369; 10 2.518,-3.099; 11 2.518,-1.829; 12 2.518,-0.559; 13 2.518,0.711; 14 2.518,1.981; 15 2.518,3.251; 16 2.518,4.521
38-SMD_MODULE = smd 2 x 1: 1 -8.8,5.485; 2 -8.8,4.215; 3 -8.8,2.945; 4 -8.8,1.675; 5 -8.8,0.405; 6 -8.8,-0.865; 7 -8.8,-2.135; 8 -8.8,-3.405; 9 -8.8,-4.675; 10 -8.8,-5.945; 11 -8.8,-7.215; 12 -8.8,-8.485; 13 -8.8,-9.755; 14 -8.8,-11.025; 25 8.9,-11.025; 26 8.9,-9.755; 27 8.9,-8.485; 28 8.9,-7.215; 29 8.9,-5.945; 30 8.9,-4.675; 31 8.9,-3.405; 32 8.9,-2.135; 33 8.9,-0.865; 34 8.9,0.405; 35 8.9,1.675; 36 8.9,2.945; 37 8.9,4.215; 38 8.9,5.485 | smd 1 x 2: 15 -5.715,-12.325; 16 -4.445,-12.325; 17 -3.175,-12.325; 18 -1.905,-12.325; 19 -0.635,-12.325; 20 0.635,-12.325; 21 1.905,-12.325; 22 3.175,-12.325; 23 4.445,-12.325; 24 5.715,-12.325 | smd 3.7 x 3.7 bottom: 48 -1.5,-0.805 | smd 3.556 x 3.556: P$1 -1.524,-0.762 | hole 0.3: -2.54,0.381; -2.54,-0.635; -2.54,-1.651; -1.524,-1.651; -1.524,-0.635; -1.524,0.381; -0.508,0.381; -0.508,-0.635; -0.508,-1.651
4-SMD = smd 1.5 x 1.3: 1 -1.4,-1.05; 3 1.4,1.05; GND@1 1.4,-1.05; GND@2 -1.4,1.05

### Placement (x,y rotation side)
C1  23.5,11.3 270 top
C2  16.64,11.3 90 top
C3  9.78,21.08 90 top
C7  22.22,6.22 0 top
C8  7.62,10.79 270 top
C9  8,21.08 270 top
C10  9.4,10.79 270 top
C11  7.11,7.75 180 top
D2  21.46,3.43 90 top
D4  8,3.3 90 top
F1  5.84,10.79 90 top
IC2  11.05,15.88 90 top
J1  3.3,9.14 90 bottom
J2  14.73,3.68 0 top
J3  26.16,9.14 90 bottom
PTC1  6.1,20.57 90 top
Q1  12.32,24 0 top
Q2  8.89,24 0 top
R2  5.1K  [0603']  13.08,9.53 0 top
R3  5.1K  [0603']  13.08,11.3 0 top
R4  10K  [0603']  22.22,7.87 0 top
R6  330  [0603']  23.11,3.43 270 top
R9  330  [0603']  6.35,3.3 270 top
R10  1K  [0603']  16.51,15.62 90 top
R11  10K  [0603']  7.11,6.1 180 top
R12  1K  [0603']  16.51,19.18 90 top
R13  10K  [0603']  22.73,25.53 0 top
R14  10K  [0603']  19.18,25.53 180 top
R15  10K  [0603']  12.7,21.97 180 top
R16  10K  [0603']  13.46,20.19 0 top
R17  10K  [0603']  16.51,22.73 90 top
S1  26.16,3.94 90 top
S2  3.3,3.81 270 top
U1  20.95,19.18 0 top
U2  14.73,40.13 0 top
X1  20.07,11.43 0 top

### Tracks (layer width: path | path; a pad name or v marks a point on that pad's centre or on a via)
3V3  (via drill 0.35)
  Top 0.305: R6.1 23.11,5.08 22.86,5.33 22.6,5.33 22.22,5.71 22.22,7.11 21.46,7.87 R4.1 | v21.08,19.94 21.92,19.1 21.92,13.7 22.38,13.25 24.05,13.25 24.54,12.76 24.54,9.14 | U2.2 10.56,44.35 12.9,46.68 27.09,46.68 27.41,46.37 27.94,45.83 27.94,23.37 27.71,23.14 27.09,23.14 25.27,23.14 24.71,23.7 U1.16
  Top 0.406: C3.2 10.61,21.08 14.3,21.08 15.13,21.91 R17.1 16.6,21.91 17.73,23.03 20.95,23.03 20.98,23.01 20.98,22.94 | v19.68,19.94 19.63,19.89 U1.4 | 21.75,23.7 21.75,25.37 R13.1 | 20.98,22.94 21.75,23.7 | U1.16 21.75,23.7 | v21.08,19.94 20.98,20.04 20.98,22.94
  Top 0.508: J3.1 24.54,9.14 21.78,9.14 21.46,8.83 21.46,7.94 R4.1 20.68,7.87 20.45,7.64 20.45,5.18 19.94,4.67 12.7,4.67 12.1,5.27 9.26,5.27 8.44,6.1 R11.1
  Top 0.813: PTC1.2 6.35,21.91 C9.1 C3.2
  Bottom 0.406: v21.08,19.94 v19.68,19.94
DATA+  (via drill 0.35)
  Top 0.305: J2.A6 14.46,8.04 14.59,8.16 15.33,8.16 15.46,8.04 J2.B6 v15.46,6.51
  Top 0.508: U1.5 19.48,18.62 v19.68,18.41
  Bottom 0.508: v19.68,18.41 16.26,18.41 15.46,17.62 v15.46,6.51
DATA-  (via drill 0.35)
  Top 0.305: J2.B7 13.97,6.98 14.1,6.85 | 14.1,6.85 14.48,6.85 | 14.48,6.85 14.83,6.85 | 14.83,6.85 14.96,6.98 J2.A7 | v16.21,5.97 15.95,5.71 14.86,5.71 14.48,6.1 14.48,6.47 | 14.48,6.85 14.48,6.5 | 14.83,6.85 14.48,6.5 | 14.48,6.5 14.48,6.47 | 14.48,6.47 14.1,6.85
  Top 0.508: U1.6 19.61,17.35 v19.68,17.27
  Bottom 0.508: v19.68,17.27 16.76,17.27 16.26,16.76 16.26,6.02 v16.21,5.97
DTR  (via drill 0.35)
  Top 0.305: R16.1 v11.05,20.19 | Q2.2 11.29,26.02 v11.3,26.03
  Top 0.406: U1.13 22.3,19.89 v22.22,19.81
  Bottom 0.305: v11.3,26.03 11.05,25.78 v11.05,20.19 11.05,19.56 11.35,19.26 21.36,19.26 21.92,19.81 v22.22,19.81
ESP32_A4  (via drill 0.35)
  Top 0.305: U2.8 6.06,36.6 8.74,36.6 v8.76,36.58
  Bottom 0.305: J1.10 5.17,32 5.49,32.32 5.49,36.26 5.8,36.58 v8.76,36.58
ESP32_A5  (via drill 0.35)
  Top 0.305: U2.9 6.06,35.33 8.74,35.33 v8.76,35.31
  Bottom 0.305: v8.76,35.31 6.26,35.31 5.94,34.99 5.94,29.78 5.63,29.46 J1.9
ESP32_A6  (via drill 0.35)
  Top 0.305: U2.6 6.06,39.14 8.74,39.14 v8.76,39.12
  Bottom 0.305: v8.76,39.12 4.89,39.12 4.57,38.8 4.57,37.4 4.25,37.08 J1.12
ESP32_A7  (via drill 0.35)
  Top 0.305: U2.7 6.06,37.87 8.74,37.87 v8.76,37.85
  Bottom 0.305: v8.76,37.85 5.35,37.85 5.03,37.53 5.03,34.86 4.71,34.54 J1.11
ESP32_A8  (via drill 0.35)
  Top 0.305: U2.10 6.06,34.06 8.74,34.06 v8.76,34.04
  Bottom 0.305: v8.76,34.04 6.72,34.04 6.4,33.72 6.4,27.24 6.08,26.92 J1.8
ESP32_A9  (via drill 0.35)
  Top 0.305: U2.11 6.06,32.79 8.74,32.79 v8.76,32.77
  Bottom 0.305: J1.7 6.54,24.38 6.86,24.7 6.86,32.45 7.18,32.77 v8.76,32.77
ESP32_EN  (via drill 0.35)
  Top 0.305: U2.3 6.06,42.95 8.74,42.95 | 8.74,42.95 v8.76,42.93 | Q1.3 14.32,26.11 v15.94,26.11 | v15.93,31.04 15.93,42.63 15.61,42.95 8.74,42.95 | 25.04,4.06 25.16,3.94 v26.16,3.94
  Top 0.813: S1.1 25.04,4.06 S1.2 24.95,6.22 C7.2 R4.2
  Bottom 0.305: v15.94,26.11 15.94,31.03 v15.93,31.04 | v26.16,3.94 28.26,3.94 28.57,4.25 28.57,45.66 28.26,45.97 13.21,45.97 11.94,44.7 J1.15 5.08,42.93 v8.76,42.93
ESP32_IO0  (via drill 0.35)
  Top 0.305: U2.25 23.5,29.23 20.8,29.23 19.66,30.38 v19.66,32.38 | Q2.3 10.12,25.78 v9.37,25.78 5.02,25.78 4.57,25.34 4.57,6.16 S2.1
  Top 0.813: S2.2 S2.1 4.51,6.1 R11.2 C11.2
  Bottom 0.305: v9.37,25.78 9.37,27.5 9.69,27.81 10.65,27.81 10.97,28.13 10.97,31.69 11.29,32 15.68,32 16,32.32 16,32.95 16.32,33.27 19.34,33.27 19.66,32.95 v19.66,32.38
ESP32_IO2  (via drill 0.35)
  Top 0.305: U2.24 20.32,27.93 20.32,29.07 18.7,30.69 v18.7,32.41 | R9.1 6.35,4.83 6.6,5.08 8.67,5.08 9.03,4.71 11.67,4.71 12.57,3.81 12.57,0.9 12.89,0.58 27.93,0.58 28.25,0.9 28.25,16.41 27.89,16.76 J3.4
  Top 0.406: R14.1 20.45,25.97 U2.24
  Bottom 0.305: J3.4 24.07,16.76 23.75,17.08 23.75,20.42 20.24,23.93 20.24,28.7 18.7,30.25 v18.7,32.41
ESP32_IO4  (via drill 0.35)
  Top 0.305: U2.26 20.72,30.38 v20.7,30.35
  Bottom 0.305: J3.5 24.57,19.3 24.26,19.62 24.26,21.07 23.94,21.39 23.43,21.39 20.7,24.12 v20.7,30.35
ESP32_IO5  (via drill 0.35)
  Top 0.305: U2.29 20.6,34.19 v20.57,34.16
  Top 0.406: R13.2 24.96,26.92 J3.8
  Bottom 0.305: v20.57,34.16 22.29,34.16 22.61,33.84 22.61,27.24 22.92,26.92 J3.8
ESP32_IO12  (via drill 0.35)
  Top 0.305: U2.14 6.06,29.23 8.66,29.23 9.53,30.1 v9.53,33.35
  Bottom 0.305: J1.4 8.04,16.76 8.23,16.95 8.23,28.89 9.53,30.19 v9.53,33.35
ESP32_IO13  (via drill 0.35)
  Top 0.305: v13.13,32.71 12.93,32.51 11.18,32.51 10.54,31.88 10.54,28.06 U2.16
  Bottom 0.305: J1.3 8.5,14.22 8.69,14.41 8.69,28.13 9,28.45 9.97,28.45 10.51,28.99 10.51,31.88 11.1,32.46 12.88,32.46 v13.13,32.71
ESP32_IO14  (via drill 0.35)
  Top 0.305: U2.13 6.06,30.25 8.53,30.25 v8.76,30.48
  Bottom 0.305: v8.76,30.48 8.09,30.48 7.77,30.16 7.77,19.5 7.58,19.3 J1.5
ESP32_IO15  (via drill 0.35)
  Top 0.305: U2.23 19.18,29.31 18.09,30.41 18.09,32.02 17.79,32.32 v17.79,32.38
  Bottom 0.305: v17.79,32.38 17.79,32.32 18.09,32.02 18.09,30.21 19.79,28.51 19.79,23.74 23.29,20.23 23.29,14.54 23.61,14.22 J3.3
ESP32_IO18  (via drill 0.35)
  Top 0.305: U2.30 20.6,35.46 v20.57,35.43
  Bottom 0.305: v20.57,35.43 22.75,35.43 23.06,35.12 23.06,29.78 23.38,29.46 J3.9
ESP32_IO19  (via drill 0.35)
  Top 0.305: U2.31 20.6,36.73 v20.57,36.7
  Bottom 0.305: v20.57,36.7 23.2,36.7 23.52,36.38 23.52,32.32 23.84,32 J3.10
ESP32_IO21  (via drill 0.35)
  Top 0.305: U2.33 20.6,39.27 v20.57,39.24
  Bottom 0.305: v20.57,39.24 23.66,39.24 23.98,38.93 23.98,34.86 24.29,34.54 J3.11
ESP32_IO22  (via drill 0.35)
  Top 0.305: U2.36 20.6,43.08 v20.57,43.05
  Bottom 0.305: v20.57,43.05 22.1,43.05 22.99,42.16 J3.14
ESP32_IO23  (via drill 0.35)
  Top 0.305: U2.37 20.6,44.35 v20.57,44.32
  Bottom 0.305: v20.57,44.32 20.95,44.7 J3.15
ESP32_IO27  (via drill 0.35)
  Top 0.305: U2.12 6.06,31.52 8.74,31.52 v8.76,31.5
  Bottom 0.305: v8.76,31.5 7.63,31.5 7.31,31.18 7.31,22.03 7.12,21.84 J1.6
ESP32_VN  (via drill 0.35)
  Top 0.305: U2.5 6.06,40.41 8.74,40.41 v8.76,40.39
  Bottom 0.305: v8.76,40.39 6.16,40.39 5.4,39.62 J1.13
ESP32_VP  (via drill 0.35)
  Top 0.305: U2.4 6.06,41.68 8.74,41.68 v8.76,41.66
  Bottom 0.305: v8.76,41.66 8.26,42.16 J1.14
GND  (via drill 0.35)  (1 unrouted)
  Top 0.152: U1.1 18.43,24.47 v18.41,24.49 | IC2.1 15.11,13.61 15.43,13.93 15.43,19.05 15.24,19.24 10.13,19.24 9.78,19.6 9.78,19.96
  Top 0.305: J2.B1 18.33,7.51 J2.SH3 | J2.B12 10.77,7.51 10.41,7.15 J2.SH2 | U2.15 9.02,28.7 10.01,29.69 10.01,32.34 v10.21,32.54 | 9.78,19.96 C3.1 | S1.3 27.29,5.87 v26.26,4.85 | S1.4 27.29,2.85 v27.25,2.89 | v17.53,29.8 17.53,30.79 17.57,30.83 17.57,31.64 17.11,32.1 17.11,32.67 17.17,32.73 17.17,34.45 v17.27,34.54
  Bottom 0.305: v18.41,24.49 17.53,25.37 v17.53,29.8
  pour Top (rank 6): -1.02,-1.02 30.73,-1.02 30.73,54.86 -1.02,54.86
  pour Bottom (rank 6): -1.78,-3.56 31.24,-3.56 31.24,57.4 -1.78,57.4
N$1
  Top 0.406: D2.1 R6.2
N$2
  Top 0.305: J2.A5 13.46,9.08 R2.2
N$3
  Top 0.305: J2.B5 16.46,8.45 16.14,8.76 15.56,8.76 15.24,9.08 15.24,10.98 14.92,11.3 R3.2
N$4
  Top 0.305: C1.1 23.14,12.48 X1.3 21.47,15.76 21.15,16.08 U1.7
N$5
  Top 0.305: U1.8 19.75,14.81 20.07,14.49 20.07,10.7 19.75,10.38 X1.1 18.57,10.48 C2.1
N$8
  Top 0.406: R9.2 D4.1
N$10
  Top 0.305: R15.2 10.67,21.97 10.59,22.05 10.59,22.44 9.39,23.64 Q2.1
N$11
  pour Top (isolate 0.305): 5.08,10.79 10.03,10.79 10.29,10.79 10.92,11.43 10.92,16.76 11.18,17.02 11.3,17.14 15.24,17.14 15.37,17.14 15.75,17.53 15.75,18.92 15.49,19.18 11.94,19.18 10.16,17.4 10.03,17.27 10.03,16 10.03,13.97 9.14,13.08 5.46,13.08 4.95,12.57 4.95,10.79
N$13
  Top 0.305: U1.3 20.05,21.16 20.37,20.84 20.37,16.91 20.05,16.59 19.15,16.59 19.1,16.63 17.75,16.63 17.53,16.41 17.53,15.11 17.21,14.8 R10.1
N$14
  Top 0.305: U1.2 17.84,22.43 17.53,22.11 17.53,19.3 | 17.53,19.3 17.53,18.61 17.21,18.29 16.57,18.29 R12.1 | 17.53,19.3
N$16  (via drill 0.35)
  Top 0.305: R16.2 v15.37,20.19 | v12.83,26.03 Q1.1
  Bottom 0.305: v12.83,26.03 14.41,26.03 14.73,25.72 14.73,20.83 v15.37,20.19
N$47
  pour Top (isolate 0.305): 4.7,20.32 4.7,14.61 5.21,14.1 5.59,13.72 8.76,13.72 9.27,14.22 9.27,18.54 7.37,20.45 4.83,20.45
RTS  (via drill 0.35)
  Top 0.305: v16.38,25.27 15.04,25.27 14.72,24.96 Q1.2 14.72,22.29 14.4,21.97 R15.1
  Top 0.406: U1.14 22.05,21.16 v21.72,20.83
  Bottom 0.305: v21.72,20.83 16.83,20.83 16.38,21.27 v16.38,25.27
RX  (via drill 0.35)
  Top 0.152: v17.58,13.77 v17.57,13.76 15.89,13.76 15.73,13.92 15.73,16.22 15.96,16.45 R10.2
  Top 0.305: U2.35 20.6,41.81 | 20.6,41.81 v20.57,41.78 | R17.2 16.51,24.43 17.07,24.99 17.07,25.56 16.85,25.78 v16.85,26.28 | v16.89,31.12 16.59,31.42 16.59,40.49 17.91,41.81 20.6,41.81 | v14.12,32.82 v14.12,30.17
  Bottom 0.305: J3.13 25.21,39.62 24.89,39.94 24.89,41.39 24.57,41.71 20.65,41.71 v20.57,41.78 20.42,41.94 10.76,41.94 10.44,41.62 10.44,34.67 10.76,34.35 13.8,34.35 14.12,34.03 v14.12,32.82 | v16.85,26.28 16.85,31.07 v16.89,31.12 | v17.58,13.77 16.89,13.08 16.89,5.45 16.57,5.13 12.89,5.13 12.57,5.45 12.57,7.56 12.26,7.88 11.28,7.88 10.37,8.8 10.37,20.48 10.41,20.52 10.41,26.47 11.73,27.79 13.8,27.79 14.12,28.1 v14.12,30.17
RX2  (via drill 0.35)
  Top 0.305: U2.27 20.6,31.65 v20.57,31.62
  Bottom 0.305: v20.57,31.62 21.37,31.62 21.69,31.31 21.69,23.77 23.62,21.84 J3.6
TX  (via drill 0.35)
  Top 0.305: U2.34 20.6,40.54 v20.57,40.51 | v15.43,21.17 15.43,21.1 16.05,20.48 16.05,20.46 R12.2 | v15.02,31.06 15.24,31.29 v15.24,36.5
  Bottom 0.305: J3.12 24.75,37.08 24.43,37.4 24.43,40.2 24.12,40.51 v20.57,40.51 18.59,40.51 17.98,39.9 17.98,36.93 17.55,36.5 v15.24,36.5 | v15.43,21.17 15.43,25.66 15.24,25.84 15.24,30.84 v15.02,31.06
TX2  (via drill 0.35)
  Top 0.305: U2.28 20.6,32.92 v20.57,32.89
  Bottom 0.305: v20.57,32.89 21.51,32.89 22.06,32.35 22.15,32.13 22.15,24.7 22.47,24.38 J3.7
VCC  (via drill 0.35)
  Top 0.305: 12.46,7.64 J2.B9 J2.A4 12.51,7.18 12.51,7.03 14.28,5.26 16.59,5.26 16.89,5.56 16.89,6.68 17.17,6.96 17.17,7.3 J2.B4 J2.A9 | 5.43,9.56 F1.1
  Top 0.406: v5.25,8.69 5.25,9.38 5.43,9.56 | F1.1 5.84,9.41 6.31,8.94 9.14,8.94 9.75,8.33 11.81,8.33 11.83,8.35 12.17,8 12.17,7.52 J2.A4 | J1.1 v3.3,6.68
  Bottom 0.406: v3.3,6.68 4.55,6.68 5.25,7.39 v5.25,8.69

### Text on the board
tPlace: EN | 23 | VP | 22 | VN | TX | A6 | RX | A7 | 21 | A4 | 19 | A5 | 18 | A8 | 05 | A9 | TX2 | 27 | RX2 | 14 | 04 | 12 | 02 | 13 | 15 | VIN | 3V3
bPlace: En Pin | Communication / Pins | Analog - Digital / Converters | Voltage In: / 5-12V | 3.3V OUTPUT